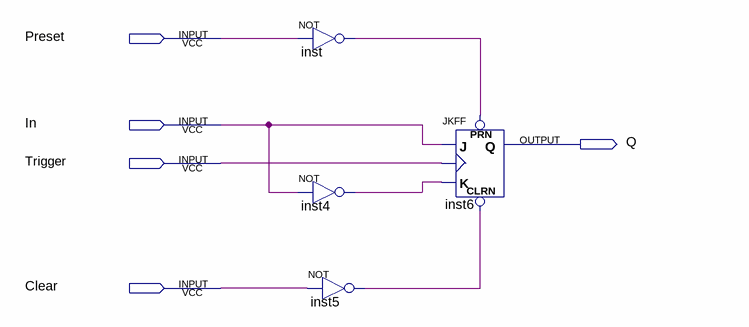
[diagram p0: schematic sheet]
// Quartus schematic ffjk.bdf as structural Verilog: 4 symbols, 5 pins
module ffjk (
  input  Preset,
  input  In,
  input  Trigger,
  input  Clear,
  output Q
);

  wire inst4_out, inst5_out, inst_out;

  not inst (inst_out, Preset);
  not inst4 (inst4_out, In);
  not inst5 (inst5_out, Clear);
  JKFF inst6 (.PRN(inst_out), .CLRN(inst5_out), .K(inst4_out), .J(In), .CLK(Trigger), .Q(Q));
endmodule
